# EAGLE design doorctl2 (EAGLE 7.5.0)
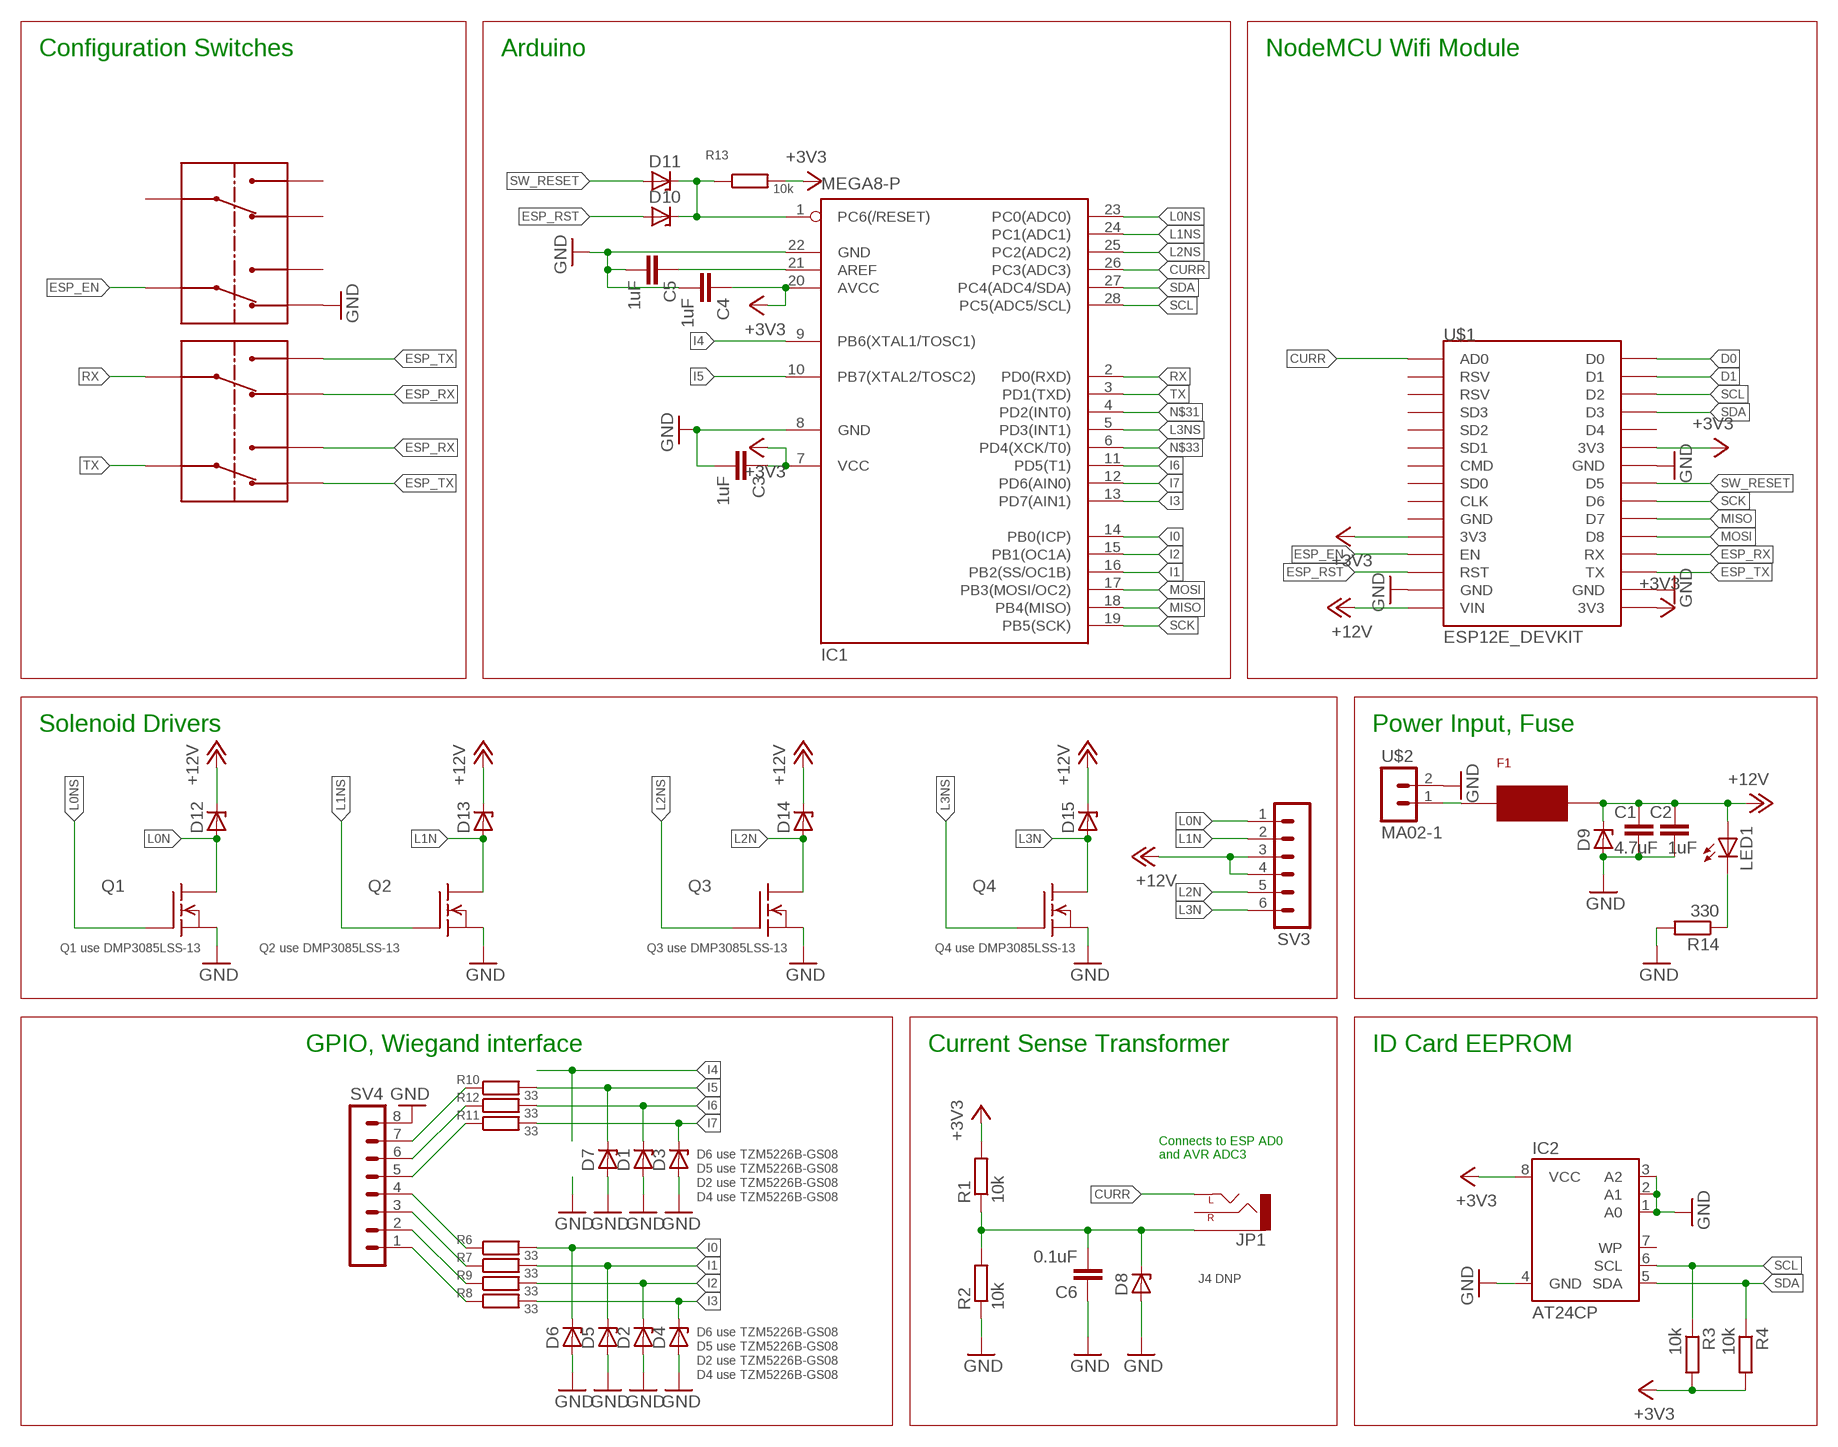
[diagram p0: schematic, sheet 1]

## Parts
C1  4.7uF  C-EUC0805  [C0805]
C2  1uF  C-EUC0805  [C0805]
C3  1uF  C-EUC0603  [C0603]
C4  1uF  C-EUC0603  [C0603]
C5  1uF  C-EUC0603  [C0603]
C6  0.1uF  C-EUC0603  [C0603]
D1  ZENER-DIODESOD80C  [SOD80C]
D2  ZENER-DIODESOD80C  [SOD80C]
D3  ZENER-DIODESOD80C  [SOD80C]
D4  ZENER-DIODESOD80C  [SOD80C]
D5  ZENER-DIODESOD80C  [SOD80C]
D6  ZENER-DIODESOD80C  [SOD80C]
D7  ZENER-DIODESOD80C  [SOD80C]
D8  ZENER-DIODESOD80C  [SOD80C]
D9  ZENER-DIODESOD80C  [SOD80C]
D10  ZENER-DIODESOT23  [SOT23]
D11  ZENER-DIODESOT23  [SOT23]
D12  ZENER-DIODESOD80C  [SOD80C]
D13  ZENER-DIODESOD80C  [SOD80C]
D14  ZENER-DIODESOD80C  [SOD80C]
D15  ZENER-DIODESOD80C  [SOD80C]
F1  0154  [0154]
IC1  MEGA8-P  [DIL28-3]
IC2  AT24CP  [DIL08]
JP1  AUDIO-JACKSMD2  [AUDIO-JACK-3.5MM-SMD]
LED1  LEDCHIP-LED0603  [CHIP-LED0603]
Q1  FDS5680  [SO-8]
Q2  FDS5680  [SO-8]
Q3  FDS5680  [SO-8]
Q4  FDS5680  [SO-8]
R1  10k  R-EU_R0603  [R0603]
R2  10k  R-EU_R0603  [R0603]
R3  10k  R-EU_R0603  [R0603]
R4  10k  R-EU_R0603  [R0603]
R6  33  R-EU_R0603  [R0603]
R7  33  R-EU_R0603  [R0603]
R8  33  R-EU_R0603  [R0603]
R9  33  R-EU_R0603  [R0603]
R10  33  R-EU_R0603  [R0603]
R11  33  R-EU_R0603  [R0603]
R12  33  R-EU_R0603  [R0603]
R13  10k  R-EU_R0603  [R0603]
R14  330  R-EU_R0603  [R0603]
SV3  MA06-1  [MA06-1]
SV4  MA08-1  [MA08-1]
SW1  L202011MS02Q  [SMT]
SW2  L202011MS02Q  [SMT]
U$1  ESP12E_DEVKIT  [ESP12E_DEVKIT]
U$2  MA02-1  [MA02-1]

## Nets
+3V3: C3.1 C4.1 IC1.7(VCC) IC1.20(AVCC) IC2.8(VCC) R1.2 R3.2 R4.2 R13.2 U$1.3V3@0(3V3) U$1.3V3@1(3V3) U$1.3V3@2(3V3)
+12V: C1.1 C2.1 D9.C D12.C D13.C D14.C D15.C F1.2 LED1.A SV3.3 SV3.4 U$1.VIN
AVR_RST: D10.3(C) D11.3(C) IC1.1(PC6(/RESET)) R13.1
CURR: IC1.26(PC3(ADC3)) JP1.TIP(LEFT) U$1.AD0
D0: U$1.D0
D1: U$1.D1
ESP_EN: SW1.A U$1.EN
ESP_RST: D10.1(A) U$1.RST
ESP_RX: SW2.A1 SW2.B2 U$1.RX
ESP_TX: SW2.A2 SW2.B1 U$1.TX
GND: C1.2 C2.2 C3.2 C4.2 C5.2 C6.1 D1.A D2.A D3.A D4.A D5.A D6.A D7.A D8.A D9.A IC1.8(GND) IC1.22(GND) IC2.1(A0) IC2.2(A1) IC2.3(A2) IC2.4(GND) Q1.1(S) Q1.2(S) Q1.3(S) Q2.1(S) Q2.2(S) Q2.3(S) Q3.1(S) Q3.2(S) Q3.3(S) Q4.1(S) Q4.2(S) Q4.3(S) R2.1 R14.2 SV4.8 SW1.A2 U$1.GND@1(GND) U$1.GND@2(GND) U$1.GND@3(GND) U$2.2
I0: D6.C IC1.14(PB0(ICP)) R6.2
I1: D5.C IC1.16(PB2(SS/OC1B)) R7.2
I2: D2.C IC1.15(PB1(OC1A)) R8.2
I3: D4.C IC1.13(PD7(AIN1)) R9.2
I4: IC1.9(PB6(XTAL1/TOSC1))
I5: D7.C IC1.10(PB7(XTAL2/TOSC2)) R10.2
I6: D1.C IC1.11(PD5(T1)) R11.2
I7: D3.C IC1.12(PD6(AIN0)) R12.2
L0N: D12.A Q1.5(D) Q1.6(D) Q1.7(D) Q1.8(D) SV3.1
L0NS: IC1.23(PC0(ADC0)) Q1.4(G)
L1N: D13.A Q2.5(D) Q2.6(D) Q2.7(D) Q2.8(D) SV3.2
L1NS: IC1.24(PC1(ADC1)) Q2.4(G)
L2N: D14.A Q3.5(D) Q3.6(D) Q3.7(D) Q3.8(D) SV3.5
L2NS: IC1.25(PC2(ADC2)) Q3.4(G)
L3N: D15.A Q4.5(D) Q4.6(D) Q4.7(D) Q4.8(D) SV3.6
L3NS: IC1.5(PD3(INT1)) Q4.4(G)
MISO: IC1.18(PB4(MISO)) U$1.D7
MOSI: IC1.17(PB3(MOSI/OC2)) U$1.D8
N$3: R6.1 SV4.4
N$8: R7.1 SV4.3
N$9: R8.1 SV4.2
N$10: R9.1 SV4.1
N$12: C6.2 D8.C JP1.SLEEVE R1.1 R2.2
N$15: R10.1 SV4.7
N$16: R11.1 SV4.6
N$17: R12.1 SV4.5
N$21: F1.1 U$2.1
N$23: C5.1 IC1.21(AREF)
N$31: IC1.4(PD2(INT0))
N$33: IC1.6(PD4(XCK/T0))
N$43: LED1.C R14.1
RX: IC1.2(PD0(RXD)) SW2.B
SCK: IC1.19(PB5(SCK)) U$1.D6
SCL: IC1.28(PC5(ADC5/SCL)) IC2.6(SCL) R3.1 U$1.D2
SDA: IC1.27(PC4(ADC4/SDA)) IC2.5(SDA) R4.1 U$1.D3
SW_RESET: D11.1(A) U$1.D5
TX: IC1.3(PD1(TXD)) SW2.A
Unconnected: IC2.7(WP) JP1.RING(RIGHT) SW1.A1 SW1.B SW1.B1 SW1.B2 U$1.CLK U$1.CMD U$1.D4 U$1.GND@0(GND) U$1.RSV@0(RSV) U$1.RSV@1(RSV) U$1.SD0 U$1.SD1 U$1.SD2 U$1.SD3

## Notes on the sheet
- Configuration Switches | Arduino | NodeMCU Wifi Module
- Solenoid Drivers | Power Input, Fuse
- Q1 use DMP3085LSS-13 | Q2 use DMP3085LSS-13 | Q3 use DMP3085LSS-13 | Q4 use DMP3085LSS-13
- GPIO, Wiegand interface | Current Sense Transformer | ID Card EEPROM
- D6 use TZM5226B-GS08
- Connects to ESP AD0
  and AVR ADC3
- D5 use TZM5226B-GS08
- D2 use TZM5226B-GS08
- D4 use TZM5226B-GS08
- J4 DNP
- D6 use TZM5226B-GS08
- D5 use TZM5226B-GS08
- D2 use TZM5226B-GS08
- D4 use TZM5226B-GS08

## Library data of the parts
C1-C6 = rcl:C-EU: CAPACITOR, European symbol
D1-D15 = diode:ZENER-DIODE: Z-Diode
F1 = SMT_Fuse_0154001:0154
IC1 = atmel:MEGA8-P: MICROCONTROLLER 8 Kbytes FLASH, 1 kbytes SRAM, 512 bytes EEPROM, USART, 4-channel 10 bit ADC, 2-channel 8 bit ADC Pin compatible with Atmega48, ATMega88, ATMega168 Source: avr.lbr; OC_FARNELL: unknown; OC_NEWARK: unknown
IC2 = atmel:AT24C*: 2-wire serial EEPROM; MPN: AT24C1024BW-SH-B; OC_FARNELL: 1362646; OC_NEWARK: 03P2044
JP1 = SparkFun-Connectors:AUDIO-JACK: 3.5mm Audio Jack Simple 3.5mm common PCB mount audio jack. SKU: PRT-08032; PROD_ID: CONN-10353
LED1 = led:LED: LED OSRAM: - CHIPLED LG R971, LG N971, LY N971, LG Q971, LY Q971, LO R971, LY R971 LH N974, LH R974 LS Q976, LO Q976, LY Q976 LO Q996 - Hyper CHIPLED LW Q18S LB Q993, LB Q99A, LB R99A - SideLED LS A670, LO A670, LY A670, LG A670, LP A670 LB A673, LV A673, LT A673, LW A673 LH A674 LY A675 LS A676, LA A676, LO A676, LY A676, LW A676 LS A679, LY A679, LG A679 - Hyper Micro SIDELED® LS Y876, LA Y876, LO Y876, LY Y876 LT Y87S - SmartLED LW L88C, LW L88S LB L89C, LB L89S, LG L890 LS L89K, LO L89K, LY L89K LS L896, LA L896, LO L896, LY L896 - TOPLED LS T670, LO T670, LY T670, LG T670, LP T670 LSG T670, LSP T670, LSY T670, LOP T670, LYG T670 LG T671, LOG T671, LSG T671 LB T673, LV T673, LT T673, LW T673 LH T674 LS T676, LA T676, LO T676, LY T676, LB T676, LH T676, LSB T676, LW T676 LB T67C, LV T67C, LT T67C, LS T67K, LO T67K, LY T67K, LW E67C LS E67B, LA E67B, LO E67B, LY E67B, LB E67C, LV E67C, LT E67C LW T67C LS T679, LY T679, LG T679 LS T770, LO T770, LY T770, LG T770, LP T770 LB T773, LV T773, LT T773, LW T773 LH T774 LS E675, LA E675, LY E675, LS T675 LS T776, LA T776, LO T776, LY T776, LB T776 LHGB T686 LT T68C, LB T68C - Hyper Mini TOPLED® LB M676 - Mini TOPLED Santana® LG M470 LS M47K, LO M47K, LY M47K Source: http://www.osram.convergy.de LUXEON: - LUMILED® LXK2-PW12-R00, LXK2-PW12-S00, LXK2-PW14-U00, LXK2-PW14-V00 LXK2-PM12-R00, LXK2-PM12-S00, LXK2-PM14-U00 LXK2-PE12-Q00, LXK2-PE12-R00, LXK2-PE12-S00, LXK2-PE14-T00, LXK2-PE14-U00 LXK2-PB12-K00, LXK2-PB12-L00, LXK2-PB12-M00, LXK2-PB14-N00, LXK2-PB14-P00, LXK2-PB14-Q00 LXK2-PR12-L00, LXK2-PR12-M00, LXK2-PR14-Q00, LXK2-PR14-R00 LXK2-PD12-Q00, LXK2-PD12-R00, LXK2-PD12-S00 LXK2-PH12-R00, LXK2-PH12-S00 LXK2-PL12-P00, LXK2-PL12-Q00, LXK2-PL12-R00 Source: www.luxeon.com KINGBRIGHT: KA-3528ASYC Source: www.kingbright.com
Q1-Q4 = transistor-fet:FDS5680: 60V N-Channel PowerTrench TM MOSFET FAIRCHILD FDS5680.pdf
R1-R4 R6-R14 = rcl:R-EU_: RESISTOR, European symbol
SV3 = con-lstb:MA06-1: PIN HEADER; OC_FARNELL: unknown; OC_NEWARK: unknown
SV4 = con-lstb:MA08-1: PIN HEADER; OC_FARNELL: unknown; OC_NEWARK: unknown
SW1 SW2 = JS202011SCQNC&K:L202011MS02Q
U$1 = ESP12E_DEVKIT:ESP12E_DEVKIT: ESP12E DEVKIT BOARD
U$2 = con-lstb-2pin:MA02-1

## Board
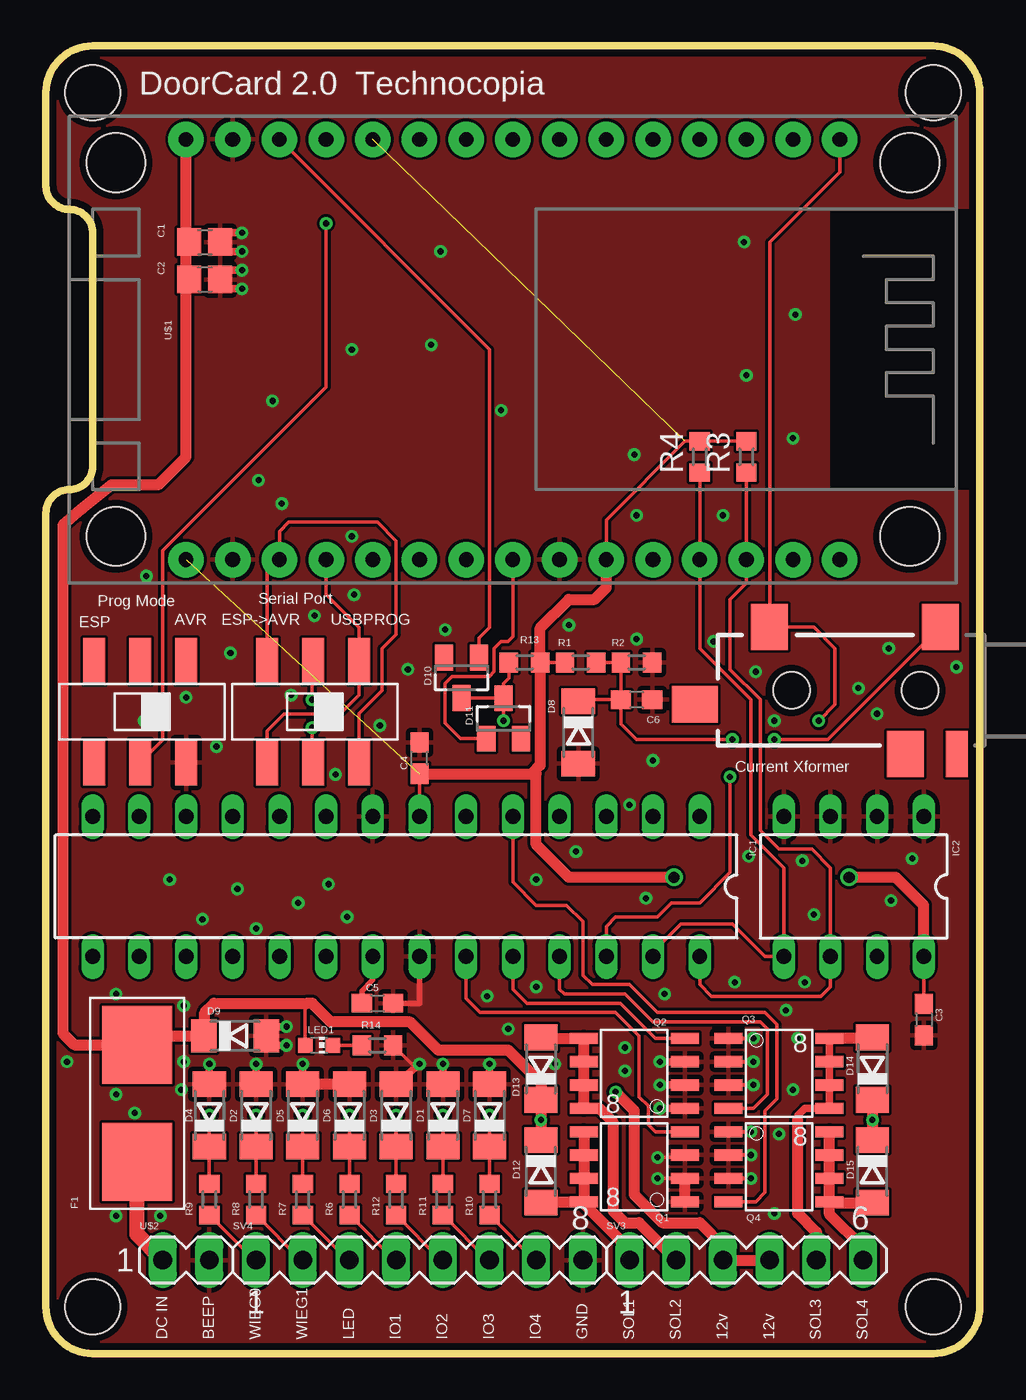
[diagram p1: board, top side]
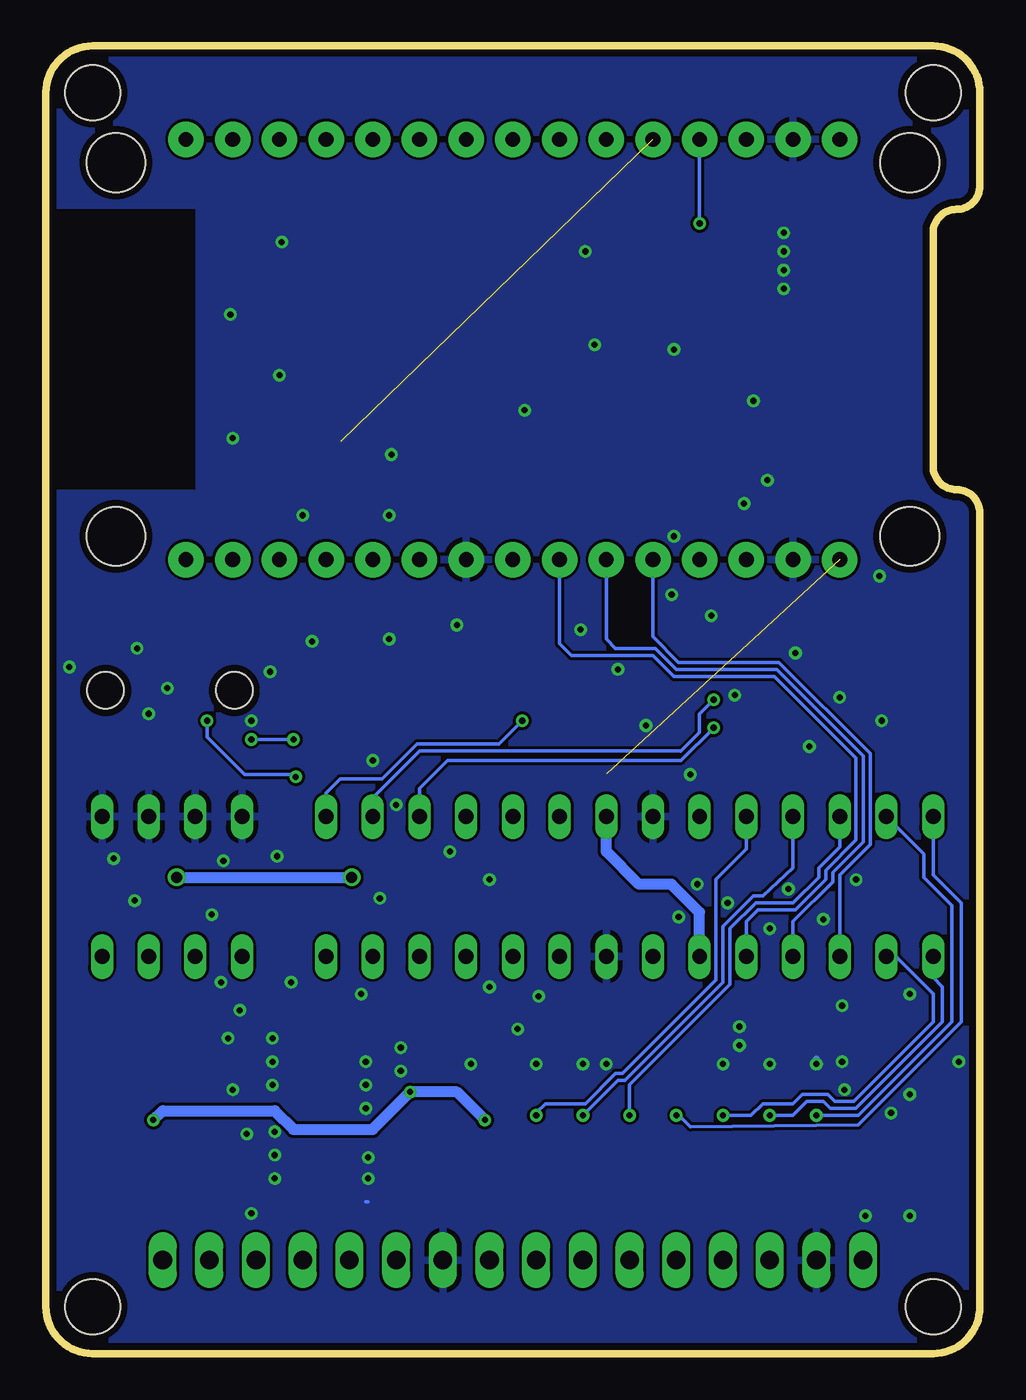
[diagram p2: board, bottom side, seen from below]

Size 50.8 x 71.12 mm. Coordinates in mm from the lower left corner, seen from the top.
Outline: 2.54,0 arc-90 0,2.54 0,45.72 arc-90 1.27,46.99 arc90 2.54,48.26 2.54,60.96 arc90 1.27,62.23 arc-90 0,63.5 0,68.58 arc-90 2.54,71.12 48.26,71.12 arc-90 50.8,68.58 50.8,2.54 arc-90 48.26,0 2.54,0
Copper layers (1*16): Top 0.0356mm / dielectric 1.5011mm / Bottom 0.0356mm
Design rules "oshpark-2layer": minimum track width 6mil, minimum drill 13mil, track to track 6mil, track to pad 6mil, pad to pad 6mil, via to via 6mil, smd to smd 6mil, copper to edge 15mil, drill to drill 6mil, minimum pad ring 7mil, minimum via ring 7mil, stop-mask expansion 2.5mil, vias tented up to drill 0mil, thermal gap 10mil
Holes 3 mm at 48.26,2.54 2.54,2.54 48.26,68.58 2.54,68.58
tRestrict: area 42.7,47 to 51.7,62.2
bRestrict: area 42.7,47 to 51.7,62.2

### Footprints (pad centres in the part's own frame; a part is rotated, then mirrored left to right if it is on the bottom)
C0805 = smd 1.3 x 1.5: 1 -0.85,0; 2 0.85,0
C0603 = smd 1.1 x 1: 1 -0.85,0; 2 0.85,0
SOD80C = smd 1.4 x 1.8: A 1.7,0; C -1.7,0
SOT23 = smd 1 x 1.4: 1 -0.95,-1.1; 2 0.95,-1.1; 3 0,1.1
0154 = smd 4.24 x 3.81: 1 0,0; 2 6.38,0
DIL28-3 = drill 0.813 long: 1 -16.51,-3.81; 2 -13.97,-3.81; 3 -11.43,-3.81; 4 -8.89,-3.81; 5 -6.35,-3.81; 6 -3.81,-3.81; 7 -1.27,-3.81; 8 1.27,-3.81; 9 3.81,-3.81; 10 6.35,-3.81; 11 8.89,-3.81; 12 11.43,-3.81; 13 13.97,-3.81; 14 16.51,-3.81; 15 16.51,3.81; 16 13.97,3.81; 17 11.43,3.81; 18 8.89,3.81; 19 6.35,3.81; 20 3.81,3.81; 21 1.27,3.81; 22 -1.27,3.81; 23 -3.81,3.81; 24 -6.35,3.81; 25 -8.89,3.81; 26 -11.43,3.81; 27 -13.97,3.81; 28 -16.51,3.81
DIL08 = drill 0.813 long: 1 -3.81,-3.81; 2 -1.27,-3.81; 3 1.27,-3.81; 4 3.81,-3.81; 5 3.81,3.81; 6 1.27,3.81; 7 -1.27,3.81; 8 -3.81,3.81
AUDIO-JACK-3.5MM-SMD = smd 2 x 2.5: RING 4.3,3.45; SLEEVE 2.4,-3.45; TIP 11.7,-3.45 | smd 1.2 x 2.5: RSH 1.5,3.45 | smd 2.5 x 2: TSH 15.75,0.75 | hole 2: 3.5,0; 10.5,0
CHIP-LED0603 = smd 0.8 x 0.8: A 0,-0.75; C 0,0.75
SO-8 = smd 1.524 x 0.61: 1 -2.743,1.905; 2 -2.743,0.635; 3 -2.743,-0.635; 4 -2.743,-1.905; 5 2.743,-1.905; 6 2.743,-0.635; 7 2.743,0.635; 8 2.743,1.905
R0603 = smd 1 x 1.1: 1 -0.85,0; 2 0.85,0
MA06-1 = drill 1.016 long: 1 -6.35,0; 2 -3.81,0; 3 -1.27,0; 4 1.27,0; 5 3.81,0; 6 6.35,0
MA08-1 = drill 1.016 long: 1 -8.89,0; 2 -6.35,0; 3 -3.81,0; 4 -1.27,0; 5 1.27,0; 6 3.81,0; 7 6.35,0; 8 8.89,0
SMT = smd 1.2 x 2.5: A 3.1,1.3; A1 0.6,1.3; A2 5.6,1.3; B 3.1,6.8; B1 0.6,6.8; B2 5.6,6.8
ESP12E_DEVKIT = drill 0.8 pad 1.93: 3V3@0 -11.43,-7.62; 3V3@1 11.43,5.08; 3V3@2 11.43,-17.78; AD0 -11.43,17.78; CLK -11.43,-2.54; CMD -11.43,2.54; D0 11.43,17.78; D1 11.43,15.24; D2 11.43,12.7; D3 11.43,10.16; D4 11.43,7.62; D5 11.43,0; D6 11.43,-2.54; D7 11.43,-5.08; D8 11.43,-7.62; EN -11.43,-10.16; GND@0 -11.43,-5.08; GND@1 -11.43,-15.24; GND@2 11.43,2.54; GND@3 11.43,-15.24; RST -11.43,-12.7; RSV@0 -11.43,15.24; RSV@1 -11.43,12.7; RX 11.43,-10.16; SD0 -11.43,0; SD1 -11.43,5.08; SD2 -11.43,7.62; SD3 -11.43,10.16; TX 11.43,-12.7; VIN -11.43,-17.78 | hole 3.2: -10.16,21.59; 10.16,21.59; 10.16,-21.59; -10.16,-21.59
MA02-1 = drill 1.016 long: 1 -2.54,0; 2 0,0

### Placement (x,y rotation side)
C1  8.64,60.45 0 top
C2  8.64,58.42 0 top
C3  47.75,18.16 270 top
C4  20.32,32.38 90 top
C5  18.03,19.05 0 top
C6  32.13,35.56 180 top
D1  21.59,12.95 90 top
D2  11.43,12.95 90 top
D3  19.05,12.95 90 top
D4  8.89,12.95 90 top
D5  13.97,12.95 90 top
D6  16.51,12.95 90 top
D7  24.13,12.95 90 top
D8  28.96,33.78 270 top
D9  10.29,17.27 0 top
D10  22.61,36.75 180 top
D11  24.89,34.54 0 top
D12  26.92,9.91 270 top
D13  26.92,15.49 90 top
D14  44.96,15.49 90 top
D15  44.96,9.91 270 top
F1  4.95,10.41 90 top
IC1  19.05,25.4 180 top
IC2  43.94,25.4 180 top
JP1  51.05,36.07 180 top
LED1  14.86,16.76 270 top
Q1  32,10.16 180 top
Q2  32,15.24 180 top
Q3  39.88,15.24 0 top
Q4  39.88,10.16 0 top
R1  29.08,37.59 180 top
R2  32.13,37.59 180 top
R3  38.1,48.77 90 top
R4  35.56,48.77 90 top
R6  16.51,8.38 90 top
R7  13.97,8.38 90 top
R8  11.43,8.38 90 top
R9  8.89,8.38 90 top
R10  24.13,8.38 90 top
R11  21.59,8.38 90 top
R12  19.05,8.38 90 top
R13  26.04,37.59 0 top
R14  18.03,16.76 0 top
SV3  38.1,5.08 0 top
SV4  20.32,5.08 0 top
SW1  2.03,30.86 0 top
SW2  11.43,30.86 0 top
U$1  25.4,54.61 270 top
U$2  8.89,5.08 0 top

### Tracks (layer width: path | path; a pad name or v marks a point on that pad's centre or on a via)
+3V3  (via drill 0.6)  (2 unrouted)
  Top 0.203: 30.48,42.67 U$1.3V3@1 30.48,45.34 34.76,49.62 R4.2 R3.2 | C4.1 IC1.7 | IC2.8 C3.1 | R1.2 R13.2
  Top 0.61: IC2.8 47.75,24.38 46.23,25.91 v43.69,25.91 | v34.16,25.91 28.45,25.91 26.67,27.69 26.67,31.54 26.42,31.54 | C4.1 26.42,31.54 | 26.42,31.54 26.89,32 R13.2 26.89,39.46 28.45,41.02 29.84,41.02 30.48,41.66 U$1.3V3@1
  Bottom 0.61: IC1.20 15.24,24 16.76,25.53 18.54,25.53 20.32,27.3 IC1.7 | v43.69,25.91 v34.16,25.91
+12V  (via drill 0.33 pad 0.51)
  Top 0.203: 8.27,17.59 D9.C | LED1.A 14.11,19.05 14.22,19.05
  Top 0.61: D15.C v44.96,12.7 D14.C 45.04,13.72 | D12.C v26.92,12.7 D13.C 26.92,14.73 25.15,16.51 21.34,16.51 19.81,18.03 15.49,18.03 14.48,19.05 14.22,19.05 9.14,19.05 8.64,18.54 8.64,17.32 D9.C 5.43,17.27 F1.2 1.55,16.79 0.91,17.42 0.91,45.06 1.93,45.92 3.56,47.24 6.1,47.24 7.62,48.77 7.62,58.42 | v30.99,14.22 32,13.21 32,8.64 33.53,7.11 35.56,7.11 36.83,5.84 SV3.3 SV3.4 | 7.62,58.42 7.62,60.52 | 7.62,60.52 U$1.VIN | C2.1 7.62,58.42 | C1.1 7.62,60.52
  Bottom 0.61: v26.92,12.7 28.45,14.22 v30.99,14.22 33.02,12.19 37.34,12.19 38.35,13.21 44.45,13.21 v44.96,12.7
AVR_RST  (via drill 0.33 pad 0.51)
  Top 0.203: D10.3 24.88,35.65 D11.3 | D11.3 24.89,36.45 25.18,36.74 R13.1 | v24.89,34.42 D11.3
  Bottom 0.203: IC1.1 35.56,30.48 34.8,31.24 32.51,31.24 30.61,33.15 26.16,33.15 v24.89,34.42
CURR  (via drill 0.33 pad 0.51)
  Top 0.203: IC1.26 30.48,23.24 30.99,23.75 33.27,23.75 34.04,24.51 35.56,24.51 37.21,26.16 v37.21,31.37 | v42.04,34.42 42.93,35.31 42.93,38.35 41.76,39.52 JP1.TIP 39.37,39.52 39.37,60.45 43.18,64.26 U$1.AD0
  Bottom 0.203: v37.21,31.37 37.34,31.5 40.01,31.5 42.04,33.53 v42.04,34.42
ESP_EN  (via drill 0.33 pad 0.51)
  Top 0.203: SW1.A 6.35,33.38 6.35,43.69 15.24,52.58 v15.24,61.47
  Bottom 0.203: v15.24,61.47 U$1.EN
ESP_RST
  Top 0.203: U$1.RST 24.13,54.61 24.13,39.5 23.56,38.92 D10.1
ESP_RX
  Top 0.203: SW2.A1 12.03,33.87 12.95,34.8 16,34.8 17.03,35.83 SW2.B2 17.03,39.48 15.24,41.27 U$1.RX
ESP_TX
  Top 0.203: SW2.B1 12.03,42.51 U$1.TX 12.7,44.7 13.21,45.21 18.03,45.21 19.05,44.2 19.05,39.12 18.29,38.35 18.29,36.07 17.03,34.81 SW2.A2
GND  (via drill 0.33 pad 0.51)
  Top 0.203: Q1.2 v33.27,9.53 | Q1.3 34.62,10.67 v33.27,10.67 | Q4.3 v38.35,9.53 | Q4.2 v38.35,10.8 | Q4.1 v38.35,12.07 | Q3.1 v38.48,17.14 | Q3.2 v38.48,15.88 | Q3.3 v38.48,14.61 | R14.2 19.9,15.75 v20.32,15.75
  Top 0.305: C5.2 20.32,19.05 IC1.22
  Top 0.406: D4.A v8.89,15.75 | D2.A v11.43,15.75 | D5.A v13.97,15.75 | D3.A v20.32,15.75 | D1.A v21.59,15.75 | D7.A v24.13,15.75 | D9.A 11.99,16.76 v13.08,16.76 | 11.99,17.78 v13.08,17.78 | 9.57,60.96 v10.67,60.96 | 9.57,59.94 v10.67,59.94 | 9.57,58.93 v10.67,58.93 | 9.57,57.91 v10.67,57.91 | Q2.1 v33.4,13.34 | Q2.2 v33.4,14.61 | Q2.3 v33.4,15.88
  Top 0.61: D6.A D5.A | Q1.1 Q1.2
  Bottom 0.203: v33.27,9.53 33.4,9.53 | 33.27,8.25 33.4,8.25 | v33.27,10.67 33.4,10.67 | v38.35,9.53 38.48,9.53 | v38.35,10.8 38.48,10.8 | v38.35,12.07 38.48,12.07 | v38.48,17.14 38.61,17.14 | v38.48,15.88 38.61,15.88 | v38.48,14.61 38.61,14.61
  Bottom 0.406: v8.89,15.75 8.89,16 | v11.43,15.75 11.43,15.88 | v13.97,15.75 13.97,15.88 | v33.4,13.34 33.27,13.34 | v33.4,14.61 33.27,14.61 | v33.4,15.88 33.27,15.88
  other vias: 11.43,23.11 8.51,23.62 6.73,25.78 15.37,25.53 16.38,23.75 10.41,25.27 13.72,24.51 32.64,24.77 28.83,27.3 26.67,25.78 47.12,26.92 45.97,24.64 41.78,23.88 41.15,26.8 38.61,37.08 36.32,38.73 39.62,34.42 32.13,38.86 33.02,32.26 31.75,29.84 38.23,27.05 13.34,35.81 9.27,33.02 7.62,35.69 10.03,38.1 5.33,34.42 5.46,42.29 7.49,15.88 7.37,14.35 4.83,13.08 3.81,14.1 7.49,18.92 3.81,19.56 1.14,15.88 40.89,17.14 40.64,14.35 39.88,11.94 39.62,7.62 31.5,16.64 31.5,15.37 6.22,7.49 3.81,7.49 27.69,15.75 25.15,17.65 33.66,19.56 26.67,19.94 24,19.43 41.27,20.19 37.47,20.19 40.26,18.67 19.68,37.21 18.16,34.16 15.75,31.5 32,48.89 24.77,51.31 21.46,59.94 32.13,45.59 36.83,45.59 28.45,39.62 21.72,39.37 16.76,41.27 14.61,40.13 12.83,46.23 16.64,44.45 16.64,54.61 12.32,51.82 11.56,47.5 20.95,54.86 37.97,60.45 40.77,56.52 38.1,53.21 40.64,49.78 45.85,38.35 44.2,36.2 45.21,34.8 49.53,37.34
  pour Bottom: -17.02,74.93 64.77,74.93 64.77,-3.05 -17.78,-3.05 -17.78,69.85
  pour Top: -4.57,72.26 59.69,72.26 59.69,-9.14 -6.35,-9.14 -6.35,70.23
I0  (via drill 0.33 pad 0.51)
  Top 0.203: R6.2 D6.C v16.51,12.95
  Bottom 0.203: v16.51,12.95 16.51,13.08 15.75,12.32 6.6,12.45 1.02,18.03 1.02,24.51 2.54,26.04 IC1.14
I1  (via drill 0.33 pad 0.51)
  Top 0.203: R7.2 D5.C v13.97,12.95
  Bottom 0.203: 13.97,13.08 v13.97,12.95 12.45,12.95 11.81,13.59 10.16,13.59 9.65,14.1 8.26,14.1 7.87,13.72 6.86,13.72 2.54,18.03 2.54,19.56 4.57,21.59 IC1.16
I2  (via drill 0.33 pad 0.51)
  Top 0.203: R8.2 D2.C v11.43,12.95
  Bottom 0.203: 11.43,13.08 v11.43,12.95 10.16,12.95 9.4,13.72 8.51,13.72 8.13,13.34 6.73,13.34 2.03,18.03 2.03,19.94 2.54,20.45 IC1.15
I3  (via drill 0.33 pad 0.51)
  Top 0.203: R9.2 D4.C v8.89,12.95
  Bottom 0.203: 8.89,13.08 v8.89,12.95 6.6,12.95 1.52,18.03 1.52,24.38 3.05,25.91 3.05,27.18 IC1.13
I5  (via drill 0.33 pad 0.51)
  Top 0.203: R10.2 D7.C v24.13,12.95
  Bottom 0.203: v24.13,12.95 24.13,13.08 23.62,13.59 21.46,13.59 19.81,15.24 19.43,15.24 14.35,20.32 14.35,25.78 12.7,27.43 IC1.10
I6  (via drill 0.33 pad 0.51)
  Top 0.203: R11.2 D1.C v21.59,12.95
  Bottom 0.203: 21.59,13.08 v21.59,12.95 19.68,14.86 19.3,14.86 13.97,20.19 13.97,23.24 12.32,24.89 11.81,24.89 10.16,26.42 IC1.11
I7  (via drill 0.33 pad 0.51)
  Top 0.203: R12.2 D3.C v19.05,12.95
  Bottom 0.203: v19.05,12.95 19.05,14.61 13.59,20.07 13.59,23.11 12.19,24.51 10.16,24.51 8.76,25.91 8.76,26.42 7.62,27.56 IC1.12
L0N
  Top 0.61: Q1.5 Q1.6 Q1.7 Q1.8 | Q1.8 26.97,8.25 D12.A 26.75,8.21 | Q1.8 29.21,8.2 31.75,5.66 SV3.1
L0NS
  Top 0.203: Q1.4 33.15,12.07 32.77,12.45 32.77,13.46 32.26,13.97 32.26,17.27 30.99,18.54 23.62,18.54 22.86,19.3 IC1.23
L1N
  Top 0.61: D13.A 26.97,17.14 Q2.5 Q2.6 Q2.7 Q2.8 30.1,13.34 30.86,12.57 30.86,7.75 31.5,7.11 32.26,7.11 SV3.2
L1NS
  Top 0.203: 34.89,17.28 Q2.4 33.15,17.14 31.24,19.05 26.16,19.05 25.4,19.81 IC1.24
L2N
  Top 0.406: 40.89,12.7 40.89,12.95 41.27,13.34 Q3.5 Q3.6 Q3.7 Q3.8
  Top 0.61: 40.89,12.7 40.89,7.62 41.91,6.6 SV3.5 | D14.A 44.91,17.14 Q3.8
L2NS
  Top 0.203: Q3.4 38.48,13.34 39.24,14.1 39.24,17.65 38.86,18.03 33.02,18.03 31.5,19.56 28.19,19.56 27.94,19.81 IC1.25
L3N
  Top 0.406: Q4.8 Q4.7 Q4.6 Q4.5
  Top 0.61: Q4.5 42.62,7.57 44.45,5.74 SV3.6 | Q4.5 42.67,8.21 D15.A | Q4.5 Q4.8
L3NS
  Top 0.203: Q4.4 38.61,8.25 39.12,8.76 39.12,13.21 39.75,13.84 39.75,17.91 39.12,18.54 33.27,18.54 31.75,20.07 29.72,20.07 29.21,20.57 29.21,23.49 28.32,24.38 26.67,24.38 25.4,25.65 IC1.5
MISO
  Bottom 0.203: IC1.18 10.16,23.49 8,25.65 8,26.16 6.35,27.81 6.35,32.51 11.05,37.21 16.51,37.21 17.65,38.35 19.81,38.35 20.32,38.86 U$1.D7
MOSI
  Bottom 0.203: IC1.17 7.62,26.04 5.97,27.69 5.97,32.64 10.92,37.59 16.38,37.59 17.78,38.99 U$1.D8
N$3
  Top 0.203: R6.1 18.96,5.08 SV4.4
N$8
  Top 0.203: R7.1 16.42,5.08 SV4.3
N$9
  Top 0.203: R8.1 13.88,5.08 SV4.2
N$10
  Top 0.203: R9.1 11.34,5.08 SV4.1
N$12  (via drill 0.33 pad 0.51)
  Top 0.203: R1.1 R2.2 C6.2 | JP1.SLEEVE 42.54,33.4 v39.62,33.4 | v37.34,33.4 32.13,33.4 31.28,34.25 C6.2 | D8.C 29.03,35.56 C6.2
  Bottom 0.203: v39.62,33.4 v37.34,33.4
N$15
  Top 0.203: R10.1 26.58,5.08 SV4.7
N$16
  Top 0.203: R11.1 24.04,5.08 SV4.6
N$17
  Top 0.203: R12.1 21.5,5.08 SV4.5
N$21
  Top 0.813: U$2.1 4.95,6.48 F1.1
N$23
  Top 0.305: IC1.21 17.78,20.32 17.18,19.72 C5.1
N$43
  Top 0.203: R14.1 LED1.C
RX  (via drill 0.33 pad 0.51)
  Top 0.203: v14.48,35.56 14.48,37.61 SW2.B
  Bottom 0.203: IC1.2 33.02,30.23 30.48,32.77 16.26,32.77 15.24,33.78 15.24,34.8 v14.48,35.56
SCK
  Bottom 0.203: IC1.19 12.7,23.49 12.06,24.13 10.03,24.13 8.38,25.78 8.38,26.29 6.73,27.94 6.73,32.38 11.18,36.83 16.64,36.83 17.78,37.97 22.23,37.97 22.86,38.61 U$1.D6
SCL
  Top 0.203: 42.67,21.08 IC2.6 | IC2.6 42.67,26.42 41.66,27.43 39.88,27.43 38.86,28.45 38.86,35.56 37.21,37.21 37.21,41.02 38.1,41.91 U$1.D2 R3.1 | IC1.28 35.56,20.07 36.2,19.43 42.16,19.43 42.67,19.94 IC2.6
SDA
  Top 0.203: IC1.27 33.02,21.84 34.54,23.37 37.34,23.37 39.12,21.59 IC2.5 40.13,26.42 38.35,28.19 38.35,35.56 35.56,38.35 U$1.D3 R4.1
SW_RESET
  Top 0.203: D11.1 22.56,33.44 21.72,34.29 21.72,36.45 22.1,36.83 24.13,36.83 24.38,37.08 24.38,38.35 24.77,38.73 25.15,38.73 25.4,38.99 U$1.D5
TX  (via drill 0.33 pad 0.51)
  Top 0.203: v14.48,34.04 14.48,32.21 SW2.A
  Bottom 0.203: IC1.3 30.48,30.73 28.96,32.26 16.26,32.26 v14.48,34.04

### Text on the board
tNames: DoorCard 2.0 Technocopia | Prog Mode | Serial Port | ESP | AVR | ESP->AVR | USBPROG | Current Xformer | DC IN | BEEP | WIEG0 | WIEG1 | LED | IO1 | IO2 | IO3 | IO4 | GND | SOL1 | SOL2 | 12v | 12v | SOL3 | SOL4